# Altium project prjMachcambiennhietdoRS485testboard.PrjPcb
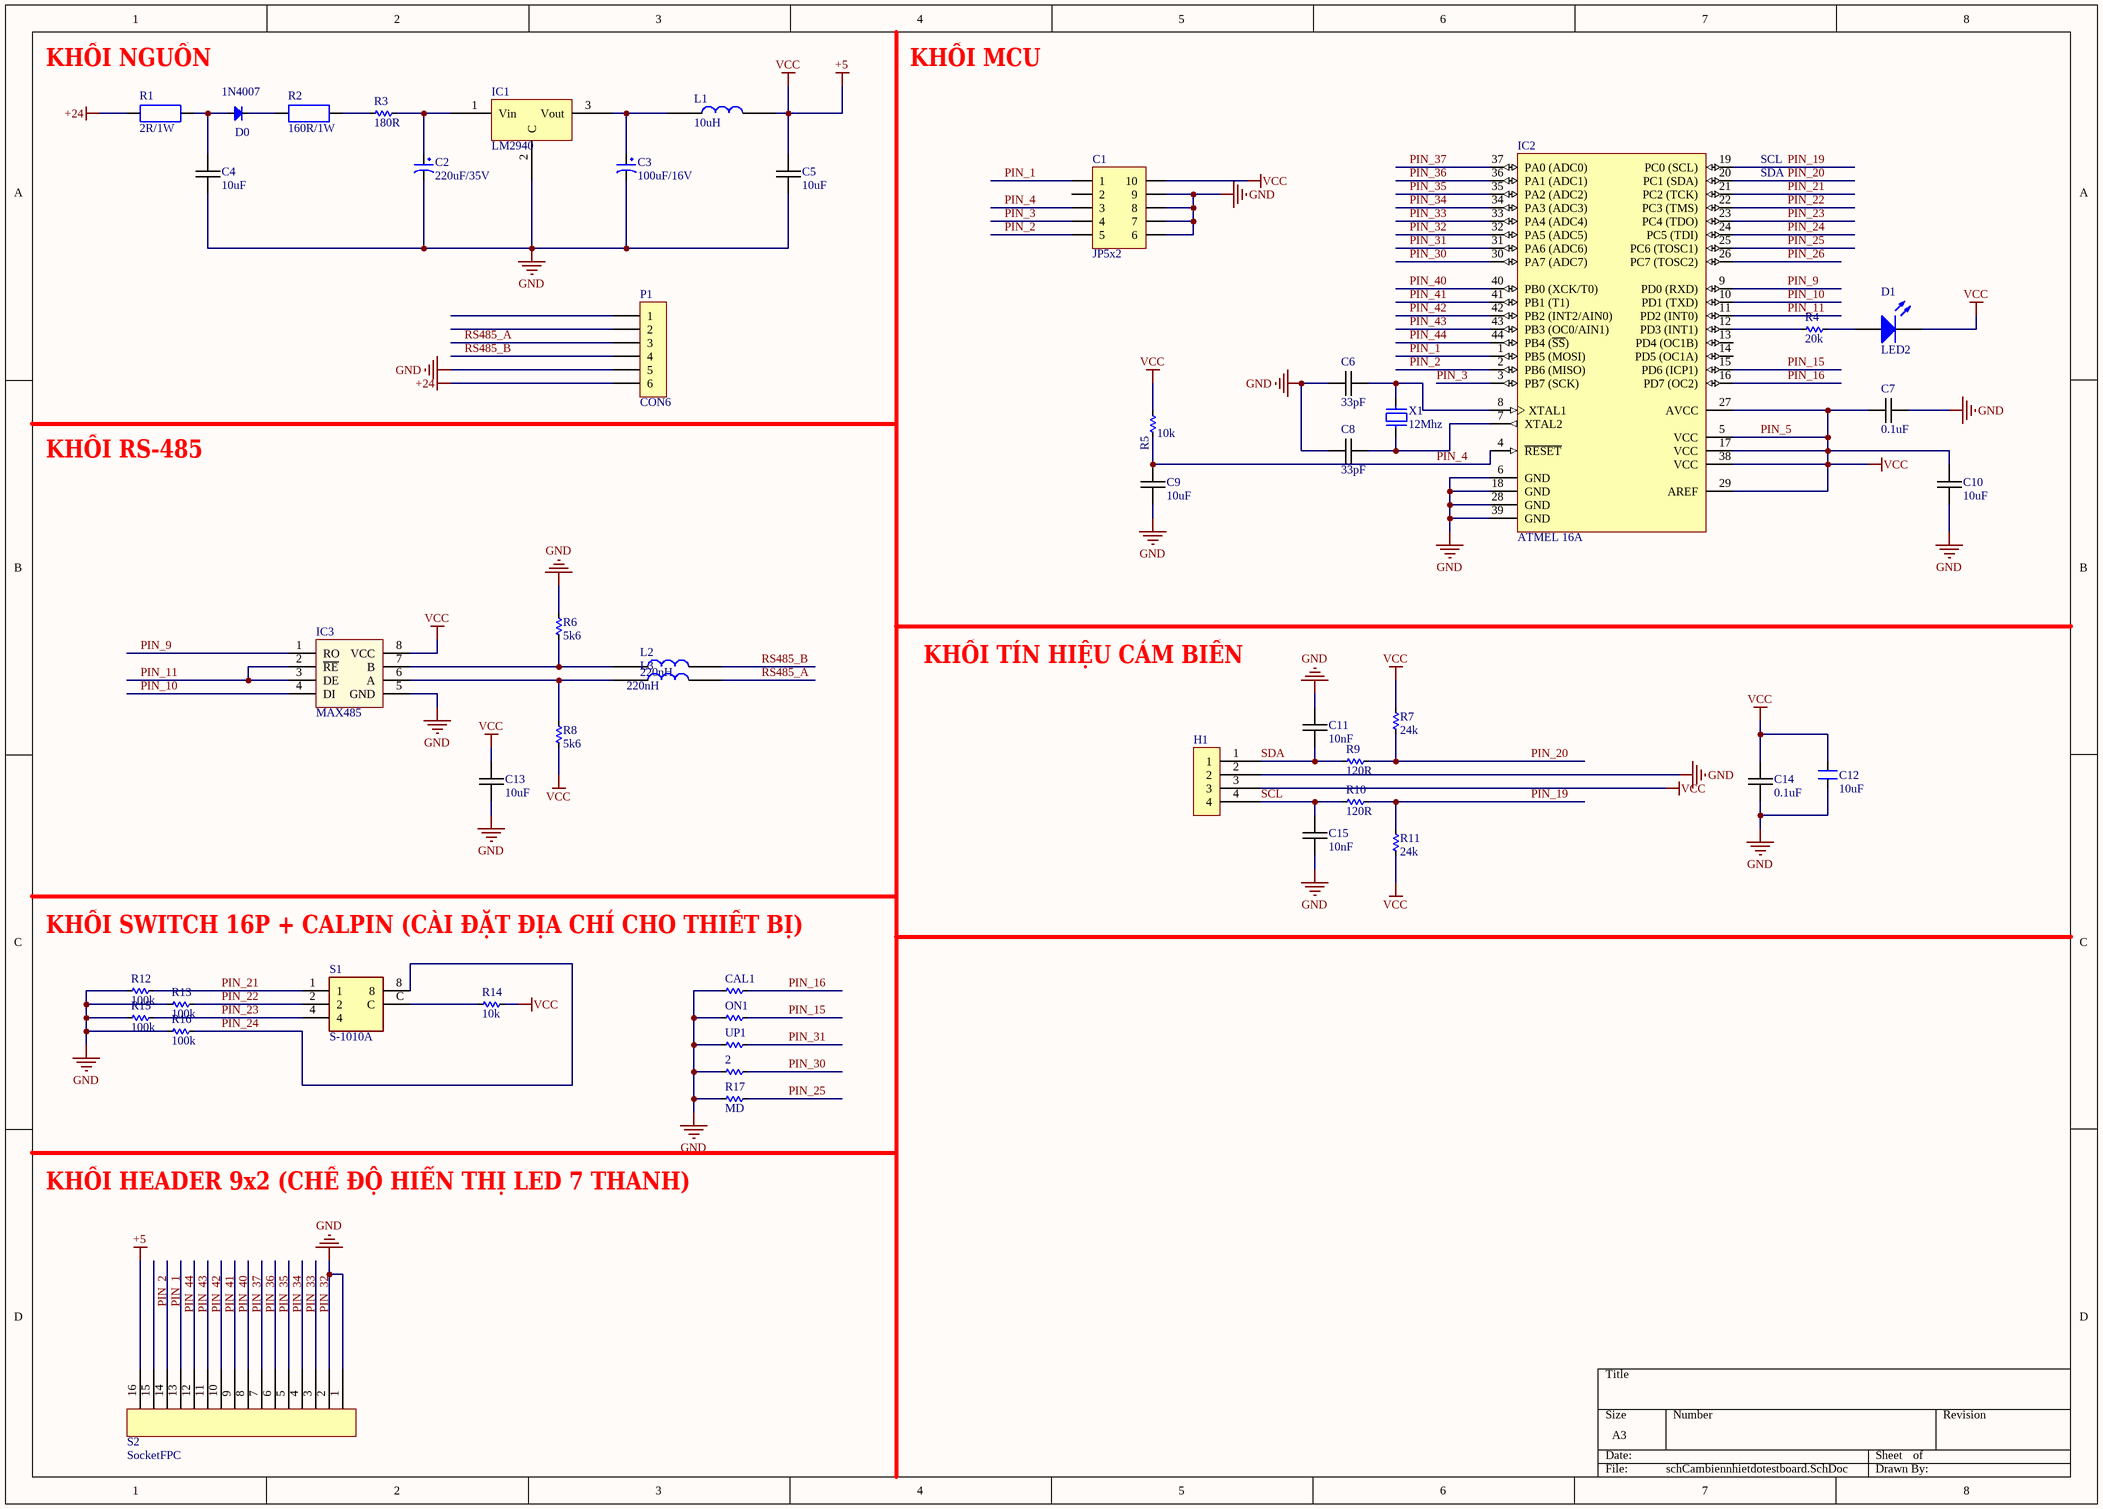
[diagram p0: schCambiennhietdotestboard.SchDoc]
1 sheet, 49 parts. Net scope: global (net labels, ports and power ports of the same name join across sheets).
Board file: pcbCambiennhietdotestboard.PcbDoc

## Sheet schCambiennhietdotestboard.SchDoc
size A3

### Parts
2  0R  [RES-SMD-0805]  (value not drawn)
C1  JP5x2  [JP5-D2T]
C2  220uF/35V  [CP1.5/3.4]
C3  100uF/16V  [CP1/2]
C4  10uF  [SM-Cap-1206]
C5  10uF  [SM-CAP-0805]
C6  33pF  [CN-SMD-0805]
C7  0.1uF  [CN-SMD-0805]
C8  33pF  [CN-SMD-0805]
C9  10uF  [CN-SMD-0805]
C10  10uF  [CN-SMD-0805]
C11  10nF  [CN-SMD-0805]
C12  10uF  [SM-Cap-1206]
C13  10uF  [CN-SMD-0805]
C14  0.1uF  [CN-SMD-0805]
C15  10nF  [CN-SMD-0805]
CAL1  0R  [RES-SMD-0805]  (value not drawn)
D0  1N4007  [DIO-SMD-106]
D1  LED2  [LED-0805-Red]
H1  Header4P  [PCBComponent_1]  (value not drawn)
IC1  LM2940  [QTO-220]
IC2  ATMEL 16A  [TQFP 44]
IC3  MAX485  [SO-8]
L1  10uH  [RES-1WD]
L2  220nH  [RES-SMD-0805]
L3  220nH  [RES-SMD-0805]
ON1  0R  [RES-SMD-0805]  (value not drawn)
P1  CON6  [4plus2PKF350]
R1  2R/1W  [R2WD]
R2  160R/1W  [R2WD]
R3  180R  [RES-SMD-2512]
R4  20k  [RES-SMD-0805]
R5  10k  [RES-SMD-0805]
R6  5k6  [RES-SMD-0805]
R7  24k  [RES-SMD-0805]
R8  5k6  [RES-SMD-0805]
R9  120R  [RES-SMD-0805]
R10  120R  [RES-SMD-0805]
R11  24k  [RES-SMD-0805]
R12  100k  [RES-SMD-0805]
R13  100k  [RES-SMD-0805]
R14  10k  [RES-SMD-0805]
R15  100k  [RES-SMD-0805]
R16  100k  [RES-SMD-0805]
R17  MD  [RES-SMD-0805]
S1  S-1010A  [A-1010S]
S2  SocketFPC  [FPC16P-0.5]
UP1  0R  [RES-SMD-0805]  (value not drawn)
X1  12Mhz  [XTAL49S-SMD]

### Nets
+24: P1.6 R1.2
GND: 2.2 C1.6 C1.7 C1.8 C1.9 C2.2 C3.2 C4.2 C5.2 C6.1 C7.2 C8.1 C9.2 C10.2 C11.1 C12.1 C13.2 C14.2 C15.1 CAL1.2 H1.2 IC1.2(C) IC2.6(GND) IC2.18(GND) IC2.28(GND) IC2.39(GND) IC3.5(GND) ON1.2 P1.5 R6.1 R12.1 R13.1 R15.1 R16.1 R17.2 S2.1 S2.2 UP1.2
PIN_5: C1.10 C5.1 C7.1 C10.1 C12.2 C13.1 C14.1 D1.2(K) H1.3 IC2.5(VCC) IC2.17(VCC) IC2.27(AVCC) IC2.29(AREF) IC2.38(VCC) IC3.8(VCC) L1.2 R5.1 R7.1 R8.2 R11.1 R14.1 S2.16  [also labelled +5, VCC]
PIN_1: C1.1 IC2.1(PB5_(MOSI)) S2.14
PIN_2: C1.5 IC2.2(PB6_(MISO)) S2.15
PIN_3: C1.4 IC2.3(PB7_(SCK))
PIN_4: C1.3 C9.1 IC2.4(~{RESET}) R5.2
PIN_9: IC2.9(PD0_(RXD)) IC3.1(RO)
PIN_10: IC2.10(PD1_(TXD)) IC3.4(DI)
PIN_11: IC2.11(PD2_(INT0)) IC3.2(~{RE}) IC3.3(DE)
PIN_15: IC2.15(PD6_(ICP1)) ON1.1
PIN_16: CAL1.1 IC2.16(PD7_(OC2))
PIN_19: IC2.19(PC0_(SCL)) R10.1 R11.2
PIN_20: IC2.20(PC1_(SDA)) R7.2 R9.2
PIN_21: IC2.21(PC2_(TCK)) R12.2 S1.1
PIN_22: IC2.22(PC3_(TMS)) R13.2 S1.2
PIN_23: IC2.23(PC4_(TDO)) R15.2 S1.4
PIN_24: IC2.24(PC5_(TDI)) R16.2 S1.8
PIN_25: IC2.25(PC6_(TOSC1)) R17.1
PIN_26: IC2.26(PC7_(TOSC2))
PIN_30: 2.1 IC2.30(PA7_(ADC7))
PIN_31: IC2.31(PA6_(ADC6)) UP1.1
PIN_32: IC2.32(PA5_(ADC5)) S2.3
PIN_33: IC2.33(PA4_(ADC4)) S2.4
PIN_34: IC2.34(PA3_(ADC3)) S2.5
PIN_35: IC2.35(PA2_(ADC2)) S2.6
PIN_36: IC2.36(PA1_(ADC1)) S2.7
PIN_37: IC2.37(PA0_(ADC0)) S2.8
PIN_40: IC2.40(PB0_(XCK/T0)) S2.9
PIN_41: IC2.41(PB1_(T1)) S2.10
PIN_42: IC2.42(PB2_(INT2/AIN0)) S2.11
PIN_43: IC2.43(PB3_(OC0/AIN1)) S2.12
PIN_44: IC2.44(PB4_(~{SS})) S2.13
RS485_A: L3.2 P1.3
RS485_B: L2.2 P1.4
SCL: C15.2 H1.4 R10.2
SDA: C11.2 H1.1 R9.1
NetC2_1: C2.1 IC1.1(Vin) R3.1
NetC3_1: C3.1 IC1.3(Vout) L1.1
NetC4_1: C4.1 D0.1(A) R1.1
NetC6_2: C6.2 IC2.8(XTAL1) X1.2
NetC8_2: C8.2 IC2.7(XTAL2) X1.1
NetD0_2: D0.2(K) R2.2
NetD1_1: D1.1(A) R4.2
NetIC2_12: IC2.12(PD3_(INT1)) R4.1
NetIC3_6: IC3.6(A) L3.1 R8.1
NetIC3_7: IC3.7(B) L2.1 R6.2
NetR2_1: R2.1 R3.2
NetR14_2: R14.2 S1.C

Not connected (* = marked no-connect by the designer): C1 2; IC2 13(PD4_(OC1B)) 14(PD5_(OC1A)); P1 1 2

### Notes on the sheet
- (near R1) KHỐI NGUỒN
- KHỐI MCU
- SCL
- SDA
- KHỐI RS-485
- KHỐI TÍN HIỆU CẢM BIẾN
- KHỐI SWITCH 16P + CALPIN (CÀI ĐẶT ĐỊA CHỈ CHO THIẾT BỊ)
- KHỐI HEADER 9x2 (CHẾ ĐỘ HIỂN THỊ LED 7 THANH)

### Library data of the parts
2 CAL1 ON1 R3-R17 UP1 = Res-SMD: Resistor; Manufacturer: Generic Components; Class: Passive; Published: 08/06/2000; Publisher: Altium Hobart Technology Centre
C1 = JP5x2: WR-PHD 2.54 mm Dual Socket Header; Manufacturer: W¨¹rth Elektronik eiSos GmbH; partNo: 61301021821; ComponentLink1 Description: Manufacturer; ComponentLink2 Description: Datasheet; NoPins: 10; Created Date: 29 March 2013; ComponentLink1URL: http://www.we-online.com; ComponentLink2URL: http://katalog.we-online.de/em/datasheet/6130xx21821.pdf; Created by: Karrer Zheng
C2 = CP3: Cap 100uF/35V - 470uF/16V; Value: 100uF/35V/50V; Description 1: 1000uF/6,3V - 470uF/16V - 330uF - 25V; Description 2: 220uF/35V - 100uF/50V - 63V - 4,7uF/200V; Description 3: 22uF => 33uF100V - 3,3uF => 4,7uF/250V; Description 4: 2,2uF =>3,3uF/350 - 2,2uF/400V - 1uF/450V
C3 = CP1: Cap P  0,1uF < 22uF , 16 - 50V; Value: 10uF/50V; Description 1: 10 => 220uF/6,3V/10V - 10uF => 100uF/16V; Description 2: 0,1uF => 33uF/50V - 10uF => 22uF/63V; Description 3: 0,47uF => 10uF/100V
C4 C6-C11 C13-C15 = 1206C-10U-35V-X7R: GENERIC CAPACITOR NON POLARISED 1206; Manufacturer Part Number: GMK316F106ZL-T; Manufacturer: Taiyo Yuden; Reel: C90; Supplier 1: Digi-Key; Supplier Part Number 1: 587-1352-2-ND
C5 = 0805C-10UF-25V-X5R-SAM: CAPACITOR 0805 CERAMIC; Manufacturer 1: Samsung; Manufacturer Part Number 1: CL21A106KACLRNC; Reel: C19; Supplier Part Number 1: CL21A106KACLRNC; Supplierr 1: Samsung
C12 = CM: Cap SMD; Value: 103
D0 = Diode SMD: Default Diode; Code - JEDEC: DO-214-AB; Value: 1N5007; Published: 8-Jun-2000; Revision: July-2002: Re-released for DXP Platform.; Publisher: Altium Limited
D1 = LED2: Typical RED, GREEN, YELLOW, AMBER GaAs LED; Published: 8-Jun-2000; LatestRevisionDate: 17-Jul-2002; LatestRevisionNote: Re-released for DXP Platform.; PackageVersion: Feb-2002; PackageReference: 3.2X1.6X1.1; Publisher: Altium Limited; PackageDescription: SM LED; 2 Flat Leads
H1 = HEADER4_PIN
IC1 = TL-780
IC2 = ATmega16A-AU: 8-bit AVR Microcontroller, 16KB Flash, 512 Bytes EEPROM, 1KB SRAM, 44-pin TQFP, Industrial Grade (-40°C to 85°C); Value: Atmega 16L
IC3 = MAX485: RS232 - RS485 (Same sn75176)
L1-L3 = L
P1 = CON6: Connector
R1 R2 = R2W: Resistor 2W; Value: R2W - 47
S1 = S-1010A: Switch; Manufacturer_Name: Copal Electronics; Allied_Number: 70041193; Datasheet Link: http://www.nidec-copal-electronics.com/e/catalog/switch/s-1000a&s-2000a.pdf; Manufacturer_Part_Number: S-1010A; RS Part Number: 3524666; RS Price/Stock: https://uk.rs-online.com/web/p/products/3524666; Allied Price/Stock: https://www.alliedelec.com/copal-s-1010a/70041193/
S2 = FPC16P: Socket FPC 16P 0.5mm
X1 = XT2: Crystal, 32.768 KHz, -40 to 85 degC, 3.2 x 1.5 x 0.9 mm SMD; Value: 4Mhz